# EAGLE design Light bar - half (EAGLE 6.5.0)
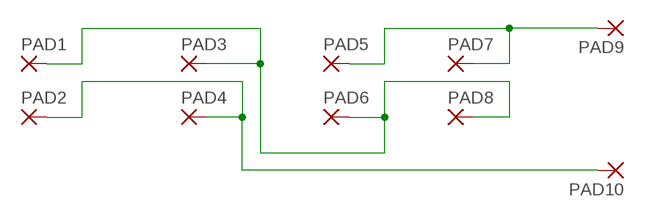
[diagram p0: schematic, sheet 1]

## Parts
PAD1  SMD2  [SMD1,27-2,54]
PAD2  SMD2  [SMD1,27-2,54]
PAD3  SMD2  [SMD1,27-2,54]
PAD4  SMD2  [SMD1,27-2,54]
PAD5  SMD2  [SMD1,27-2,54]
PAD6  SMD2  [SMD1,27-2,54]
PAD7  SMD2  [SMD1,27-2,54]
PAD8  SMD2  [SMD1,27-2,54]
PAD9  SMD5  [SMD2,54-5,08]
PAD10  SMD5  [SMD2,54-5,08]

## Nets
N$1: PAD1.1(P) PAD3.1(P) PAD6.1(P) PAD8.1(P)
N$2: PAD2.1(P) PAD4.1(P) PAD10.1(P)
N$3: PAD5.1(P) PAD7.1(P) PAD9.1(P)

## Library data of the parts
PAD1-PAD8 = wirepad:SMD2: SMD PAD
PAD9 PAD10 = wirepad:SMD5: SMD PAD

## Board
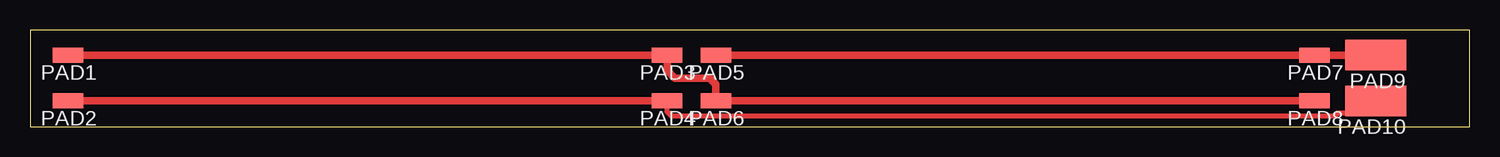
[diagram p1: board, top side]

Size 120 x 8.06 mm. Coordinates in mm from the lower left corner, seen from the top.
Outline: 0,0 120,0 120,8.06 0,8.06 0,0
Copper layers (1*16): Top 0.035mm / dielectric 1.5mm / Bottom 0.035mm
Design rules "default": minimum track width 10mil, minimum drill 0.6mm, track to track 8mil, track to pad 8mil, pad to pad 8mil, via to via 8mil, smd to smd 8mil, copper to edge 40mil, drill to drill 8mil, minimum pad ring 10mil, minimum via ring 8mil, stop-mask expansion 4mil, vias tented up to drill 0mil, thermal gap 10mil

### Footprints (pad centres in the part's own frame; a part is rotated, then mirrored left to right if it is on the bottom)
SMD1,27-2,54 = smd 1.27 x 2.54: 1 0,0
SMD2,54-5,08 = smd 2.54 x 5.08: 1 0,0

### Placement (x,y rotation side)
PAD1  3.17,5.97 90 top
PAD2  3.17,2.16 90 top
PAD3  53.09,5.97 90 top
PAD4  53.09,2.16 90 top
PAD5  57.15,5.97 90 top
PAD6  57.15,2.16 90 top
PAD7  107.06,5.97 90 top
PAD8  107.06,2.16 90 top
PAD9  112.14,5.97 90 top
PAD10  112.14,2.16 90 top

### Tracks (layer width: path | path; a pad name or v marks a point on that pad's centre or on a via)
N$1
  Top 0.61: PAD1.1 PAD3.1 53.09,4.7 53.72,4.06 56.64,4.06 57.15,3.56 PAD6.1 PAD8.1
N$2
  Top 0.406: PAD10.1 111.12,2.16 110.11,1.14 108.97,1.14 108.71,0.89 53.47,0.89 53.09,1.27 PAD4.1
  Top 0.61: PAD2.1 PAD4.1
N$3
  Top 0.61: PAD5.1 PAD7.1 PAD9.1